# EAGLE design BMS (EAGLE 6.4)
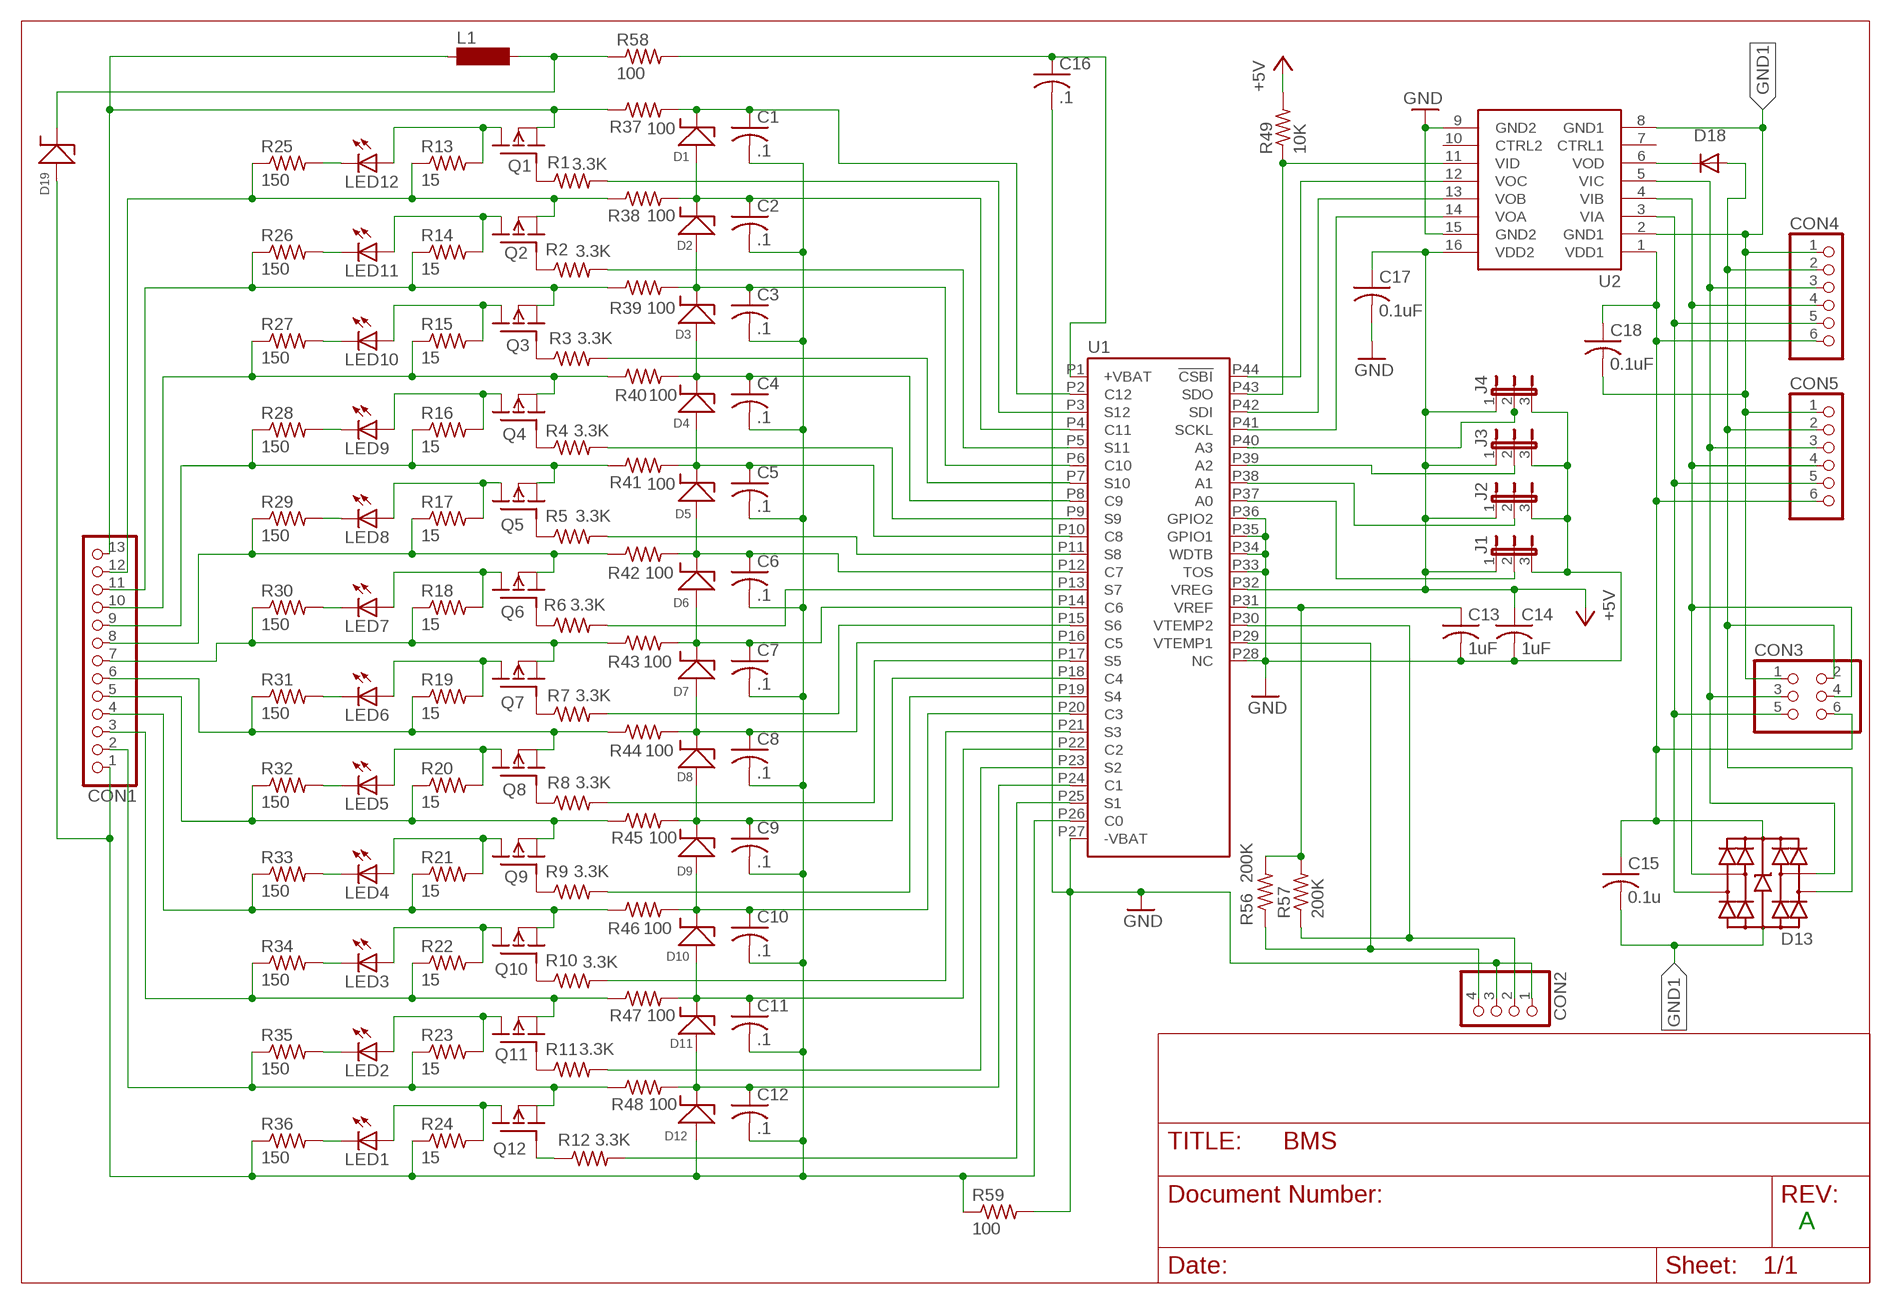
[diagram p0: schematic, sheet 1]

## Parts
C1  .1  C-USC0603  [C0603]
C2  .1  C-USC0603  [C0603]
C3  .1  C-USC0603  [C0603]
C4  .1  C-USC0603  [C0603]
C5  .1  C-USC0603  [C0603]
C6  .1  C-USC0603  [C0603]
C7  .1  C-USC0603  [C0603]
C8  .1  C-USC0603  [C0603]
C9  .1  C-USC0603  [C0603]
C10  .1  C-USC0603  [C0603]
C11  .1  C-USC0603  [C0603]
C12  .1  C-USC0603  [C0603]
C13  1uF  C-USC0603  [C0603]
C14  1uF  C-USC0603  [C0603]
C15  0.1u  C-USC0603  [C0603]
C16  .1  C-USC0603  [C0603]
C17  0.1uF  C-USC0603  [C0603]
C18  0.1uF  C-USC0603  [C0603]
CON1  PINHD-1X13/90  [1X13/90]
CON2  PINHD-1X4/90  [1X04/90]
CON3  PINHD-2X3/90  [2X03/90]
CON4  PINHD-1X6/90  [1X06/90]
CON5  PINHD-1X6/90  [1X06/90]
D1  PDZ7.5B  [SOD323]
D2  PDZ7.5B  [SOD323]
D3  PDZ7.5B  [SOD323]
D4  PDZ7.5B  [SOD323]
D5  PDZ7.5B  [SOD323]
D6  PDZ7.5B  [SOD323]
D7  PDZ7.5B  [SOD323]
D8  PDZ7.5B  [SOD323]
D9  PDZ7.5B  [SOD323]
D10  PDZ7.5B  [SOD323]
D11  PDZ7.5B  [SOD323]
D12  PDZ7.5B  [SOD323]
D13  TPD4E001DBV  [SOT23-6]
D18  DIODE0603  [LED-0603]
D19  MMSZ5265BTIG  [SOD-123_MINI-SMA]
J1  JP2E  [JP2]
J2  JP2E  [JP2]
J3  JP2E  [JP2]
J4  JP2E  [JP2]
L1  CHOKE  [CHOKE1206]
LED1  LED0603  [LED-0603]
LED2  LED0603  [LED-0603]
LED3  LED0603  [LED-0603]
LED4  LED0603  [LED-0603]
LED5  LED0603  [LED-0603]
LED6  LED0603  [LED-0603]
LED7  LED0603  [LED-0603]
LED8  LED0603  [LED-0603]
LED9  LED0603  [LED-0603]
LED10  LED0603  [LED-0603]
LED11  LED0603  [LED-0603]
LED12  LED0603  [LED-0603]
Q1  FDY102PZ  [SC89-3]
Q2  FDY102PZ  [SC89-3]
Q3  FDY102PZ  [SC89-3]
Q4  FDY102PZ  [SC89-3]
Q5  FDY102PZ  [SC89-3]
Q6  FDY102PZ  [SC89-3]
Q7  FDY102PZ  [SC89-3]
Q8  FDY102PZ  [SC89-3]
Q9  FDY102PZ  [SC89-3]
Q10  FDY102PZ  [SC89-3]
Q11  FDY102PZ  [SC89-3]
Q12  FDY102PZ  [SC89-3]
R1  3.3K  R-US_R0603  [R0603]
R2  3.3K  R-US_R0603  [R0603]
R3  3.3K  R-US_R0603  [R0603]
R4  3.3K  R-US_R0603  [R0603]
R5  3.3K  R-US_R0603  [R0603]
R6  3.3K  R-US_R0603  [R0603]
R7  3.3K  R-US_R0603  [R0603]
R8  3.3K  R-US_R0603  [R0603]
R9  3.3K  R-US_R0603  [R0603]
R10  3.3K  R-US_R0603  [R0603]
R11  3.3K  R-US_R0603  [R0603]
R12  3.3K  R-US_R0603  [R0603]
R13  15  R-US_R2512  [R2512]
R14  15  R-US_R2512  [R2512]
R15  15  R-US_R2512  [R2512]
R16  15  R-US_R2512  [R2512]
R17  15  R-US_R2512  [R2512]
R18  15  R-US_R2512  [R2512]
R19  15  R-US_R2512  [R2512]
R20  15  R-US_R2512  [R2512]
R21  15  R-US_R2512  [R2512]
R22  15  R-US_R2512  [R2512]
R23  15  R-US_R2512  [R2512]
R24  15  R-US_R2512  [R2512]
R25  150  R-US_R0603  [R0603]
R26  150  R-US_R0603  [R0603]
R27  150  R-US_R0603  [R0603]
R28  150  R-US_R0603  [R0603]
R29  150  R-US_R0603  [R0603]
R30  150  R-US_R0603  [R0603]
R31  150  R-US_R0603  [R0603]
R32  150  R-US_R0603  [R0603]
R33  150  R-US_R0603  [R0603]
R34  150  R-US_R0603  [R0603]
R35  150  R-US_R0603  [R0603]
R36  150  R-US_R0603  [R0603]
R37  100  R-US_R0603  [R0603]
R38  100  R-US_R0603  [R0603]
R39  100  R-US_R0603  [R0603]
R40  100  R-US_R0603  [R0603]
R41  100  R-US_R0603  [R0603]
R42  100  R-US_R0603  [R0603]
R43  100  R-US_R0603  [R0603]
R44  100  R-US_R0603  [R0603]
R45  100  R-US_R0603  [R0603]
R46  100  R-US_R0603  [R0603]
R47  100  R-US_R0603  [R0603]
R48  100  R-US_R0603  [R0603]
R49  10K  R-US_R0603  [R0603]
R56  200K  R-US_R0603  [R0603]
R57  200K  R-US_R0603  [R0603]
R58  100  R-US_R0603  [R0603]
R59  100  R-US_R0603  [R0603]
U1  LTC6803-2  [SSOP44]
U2  ADUM1411RW  [SO16W]

## Nets
+5V: C14.1 C17.1 J1.1 J2.1 J3.1 J4.1 R49.2 U1.P32(VREG) U2.16(VDD2)
+VBAT: C16.1 R58.2 U1.P1(+VBAT)
GND: C13.2 C14.2 C16.2 C17.2 CON2.1 CON2.3 J1.3 J2.3 J3.3 J4.3 R59.2 U1.P27(-VBAT) U1.P28(NC) U1.P33(TOS) U1.P34(WDTB) U1.P35(GPIO1) U1.P36(GPIO2) U2.9(GND2) U2.15(GND2)
GND1: C15.2 C18.2 CON3.1 CON4.1 CON5.1 D13.2(GND) U2.2(GND1) U2.8(GND1)
N$1: C8.1 D7.P$2 D8.P$1 R44.2 U1.P16(C5)
N$2: CON1.2 Q12.P$2(S) R23.1 R35.1 R48.1
N$3: C2.1 D1.P$2 D2.P$1 R38.2 U1.P4(C11)
N$4: C3.1 D2.P$2 D3.P$1 R39.2 U1.P6(C10)
N$5: C4.1 D3.P$2 D4.P$1 R40.2 U1.P8(C9)
N$6: C5.1 D4.P$2 D5.P$1 R41.2 U1.P10(C8)
N$7: C6.1 D5.P$2 D6.P$1 R42.2 U1.P12(C7)
N$8: C7.1 D6.P$2 D7.P$1 R43.2 U1.P14(C6)
N$10: C10.1 D9.P$2 D10.P$1 R46.2 U1.P20(C3)
N$11: C11.1 D10.P$2 D11.P$1 R47.2 U1.P22(C2)
N$12: C12.1 D11.P$2 D12.P$1 R48.2 U1.P24(C1)
N$13: C1.2 C2.2 C3.2 C4.2 C5.2 C6.2 C7.2 C8.2 C9.2 C10.2 C11.2 C12.2 CON1.1 D12.P$2 D19.A R24.1 R36.1 R59.1 U1.P26(C0)
N$14: Q1.P$1(G) R1.1
N$15: Q2.P$1(G) R2.1
N$16: Q3.P$1(G) R3.1
N$17: Q4.P$1(G) R4.1
N$18: Q5.P$1(G) R5.1
N$19: Q6.P$1(G) R6.1
N$20: Q7.P$1(G) R7.1
N$21: Q8.P$1(G) R8.1
N$22: Q9.P$1(G) R9.1
N$23: Q10.P$1(G) R10.1
N$24: Q11.P$1(G) R11.1
N$25: J3.2 U1.P39(A2)
N$26: LED12.A Q1.P$3(D) R13.2
N$27: LED12.C R25.2
N$28: R1.2 U1.P3(S12)
N$29: LED11.A Q2.P$3(D) R14.2
N$30: LED11.C R26.2
N$31: LED10.C R27.2
N$32: CON1.10 Q4.P$2(S) R15.1 R27.1 R40.1
N$33: LED10.A Q3.P$3(D) R15.2
N$34: R2.2 U1.P5(S11)
N$35: R3.2 U1.P7(S10)
N$36: R4.2 U1.P9(S9)
N$37: R5.2 U1.P11(S8)
N$38: R6.2 U1.P13(S7)
N$39: R7.2 U1.P15(S6)
N$40: R8.2 U1.P17(S5)
N$41: R9.2 U1.P19(S4)
N$42: R10.2 U1.P21(S3)
N$43: R11.2 U1.P23(S2)
N$44: R12.2 U1.P25(S1)
N$45: J1.2 U1.P37(A0)
N$46: CON1.13 L1.1 Q1.P$2(S) R37.1
N$47: LED7.C R30.2
N$48: LED9.A Q4.P$3(D) R16.2
N$49: LED9.C R28.2
N$50: LED8.A Q5.P$3(D) R17.2
N$51: LED7.A Q6.P$3(D) R18.2
N$52: LED8.C R29.2
N$53: CON1.12 Q2.P$2(S) R13.1 R25.1 R38.1
N$54: LED6.C R31.2
N$55: LED6.A Q7.P$3(D) R19.2
N$56: CON1.11 Q3.P$2(S) R14.1 R26.1 R39.1
N$57: CON3.2 CON4.2 CON5.2 D13.6(IO4) D18.A
N$58: LED5.A Q8.P$3(D) R20.2
N$59: LED5.C R32.2
N$60: LED4.C R33.2
N$61: LED3.C R34.2
N$62: LED4.A Q9.P$3(D) R21.2
N$63: LED3.A Q10.P$3(D) R22.2
N$64: LED2.C R35.2
N$65: LED1.A Q12.P$3(D) R24.2
N$66: LED2.A Q11.P$3(D) R23.2
N$67: CON1.9 Q5.P$2(S) R16.1 R28.1 R41.1
N$68: CON1.8 Q6.P$2(S) R17.1 R29.1 R42.1
N$69: CON1.7 Q7.P$2(S) R18.1 R30.1 R43.1
N$70: CON1.6 Q8.P$2(S) R19.1 R31.1 R44.1
N$71: CON1.5 Q9.P$2(S) R20.1 R32.1 R45.1
N$72: CON1.4 Q10.P$2(S) R21.1 R33.1 R46.1
N$73: CON1.3 Q11.P$2(S) R22.1 R34.1 R47.1
N$75: U1.P44(!CSBI) U2.12(VOC)
N$76: R49.1 U1.P43(SDO) U2.11(VID)
N$77: U1.P42(SDI) U2.13(VOB)
N$78: U1.P41(SCKL) U2.14(VOA)
N$83: CON3.5 CON4.5 CON5.5 D13.1(IO1) U2.3(VIA)
N$84: J2.2 U1.P38(A1)
N$85: CON3.4 CON4.4 CON5.4 D13.3(IO2) U2.4(VIB)
N$86: CON3.3 CON4.3 CON5.3 D13.4(IO3) U2.5(VIC)
N$89: D18.C U2.6(VOD)
N$91: J4.2 U1.P40(A3)
N$96: CON2.4 R56.1 U1.P29(VTEMP1)
N$97: CON2.2 R57.1 U1.P30(VTEMP2)
N$101: C1.1 D1.P$1 R37.2 U1.P2(C12)
N$102: D19.C L1.2 R58.1
N$103: LED1.C R36.2
N$105: Q12.P$1(G) R12.1
N$116: C9.1 D8.P$2 D9.P$1 R45.2 U1.P18(C4)
VDD1: C15.1 C18.1 CON3.6 CON4.6 CON5.6 D13.5(VCC) U2.1(VDD1)
VREF: C13.1 R56.2 R57.2 U1.P31(VREF)
Unconnected: U2.7(CTRL1) U2.10(CTRL2)

## Notes on the sheet
- A

## Library data of the parts
C1-C18 = rcl:C-US: CAPACITOR, American symbol
CON1 = pinhead:PINHD-1X13: PIN HEADER
CON2 = pinhead:PINHD-1X4: PIN HEADER
CON3 = pinhead:PINHD-2X3: PIN HEADER
CON4 CON5 = pinhead:PINHD-1X6: PIN HEADER
D1-D12 = Richard1:PDZ7.5B
D13 = m_diode:TPD4E001: 4-CHANNEL ESD PROTECTION ARRAY WITH 1.5-pF IO CAPACITANCE 4-Channel ESD Clamp Array to Enhance System-Level ESD Protection Exceeds IEC61000-4-2 (Level 4) ESD Protection Requirements ±8-kV IEC 61000-4-2 Contact Discharge ±15-kV IEC 61000-4-2 Air-Gap Discharge ±15-kV Human-Body Model (HBM) 5.5-A Peak Pulse Current (8/20-us Pulse) Low 1.5-pF Input Capacitance Low 1-nA (Max) Leakage Current 0.9-V to 5.5-V Supply-Voltage Range Space-Saving DRL, DBV, DCK, and DRS Package Options Alternate 2-, 3-, 6-Channel Options Available: TPD2E001, TPD3E001, and TPD6E001 DESCRIPTION The TPD4E001 is a low-capacitance ±15-kV ESD-protection diode array designed to protect sensitive electronics attached to communication lines. Each channel consists of a pair of diodes that steer ESD current pulses to VCC or GND. The TPD4E001 protects against ESD pulses up to ±15-kV Human-Body Model (HBM), ±8-kV Contact Discharge, and ±15-kV Air-Gap Discharge, as specified in IEC 61000-4-2. This device has a 1.5-pF IO capacitance per channel, making it ideal for use in high-speed data IO interfaces. The ultra low leakage current (1 nA max) is suitable for precision analog measurements in applications like glucose meters, heart rate monitors, etc. The TPD4E001 is available in DRL, DBV (SOT-23), DCK (SC-70), DRS (QFN), and DPK (PUSON) packages and is specified for –40°C to 85°C operation.; MANUF: TI; PARTNUM: TPD4E001DBV
D18 = Richard1:DIODE
D19 = Richard1:MMSZ5265BTIG
J1-J4 = jumper:JP2E: JUMPER
L1 = Richard:CHOKE
LED1-LED12 = Richard1:LED: LEDs Standard schematic elements and footprints for 5mm, 3mm, 1206, and 0603 sized LEDs. 5mm - Spark Fun Electronics SKU : Comp-SBL
Q1-Q12 = Richard1:FDY102PZ: Digikey FDY102PZCT-ND
R1-R49 R56-R59 = rcl:R-US_: RESISTOR, American symbol
U1 = Richard:LTC6803-2: LTC6803-2 Multicell Battery Stack Monitor DESCRIPTION The LTC®6803 is a 2nd generation, complete battery moni- toring IC that includes a 12-bit ADC, a precision voltage reference, a high voltage input multiplexer and a serial interface. Each LTC6803 can measure up to 12 series connected battery cells or supercapacitors. Many LTC6803 devices can be stacked to measure the voltage of each cell in a long battery string. Each LTC6803-2/LTC6803-4 has an individually addressable serial interface, allowing up to 16 LTC6803-2/LTC6803-4 devices to interface to one control processor and operate simultaneously. Each cell input has an associated MOSFET switch for discharging overcharged cells. The LTC6803-2 connects the bottom of the stack to V– internally. It is pin compatible with the LTC6802-2, providing a drop-in upgrade. The LTC6803-4 separates the bottom of the stack from V–, improving cell 1 measurement accuracy. The LTC6803 provides a standby mode to reduce supply current to 12μA. Furthermore, the LTC6803 can be powered from an isolated supply, providing a technique to reduce battery stack current draw to zero. The related LTC6803-1 and LTC6803-3 offer a serial in- terface that allows the serial ports of multiple LTC6803-1 or LTC6803-3 devices to be daisy chained without opto- couplers or isolators.; MANUF: Linear Technology; PARTNUM: LTC6803IG-2#PBF
U2 = Richard1:ADUM1411: Quad-Channel Digital Isolators The ADuM141x1 are four-channel digital isolators based on Analog Devices, Inc. iCoupler® technology. Combining high speed CMOS and monolithic air core transformer technologies, these isolation components provide outstanding performance characteristics superior to alternatives such as optocoupler devices. By avoiding the use of LEDs and photodiodes, iCoupler devices remove the design difficulties commonly associated with opto- couplers. The usual concerns that arise with optocouplers, such as uncertain current transfer ratios, nonlinear transfer functions, and temperature and lifetime effects, are eliminated with the simple iCoupler digital interfaces and stable performance characteristics. The need for external drivers and other discrete components is eliminated with these iCoupler products. Furthermore, iCoupler devices consume one-tenth to one-sixth the power of optocou- plers at comparable signal data rates. The ADuM141x isolators provide four independent isolation channels in a variety of channel configurations and data rates (see the Ordering Guide) up to 10 Mbps. All models operate with the supply voltage on either side ranging from 2.7 V to 5.5 V, providing compatibility with lower voltage systems as well as enabling voltage translation functionality across the isolation barrier. All products also have a default output control pin. This allows the user to define the logic state the outputs are to adopt in the absence of the input power. Unlike other optocoupler alternatives, the ADuM141x isolators have a patented refresh feature that ensures dc correctness in the absence of input logic transitions and during power-up/power-down conditions.; MANUF: Analog Devices; PARTNUM: ADuM1411A

## Board
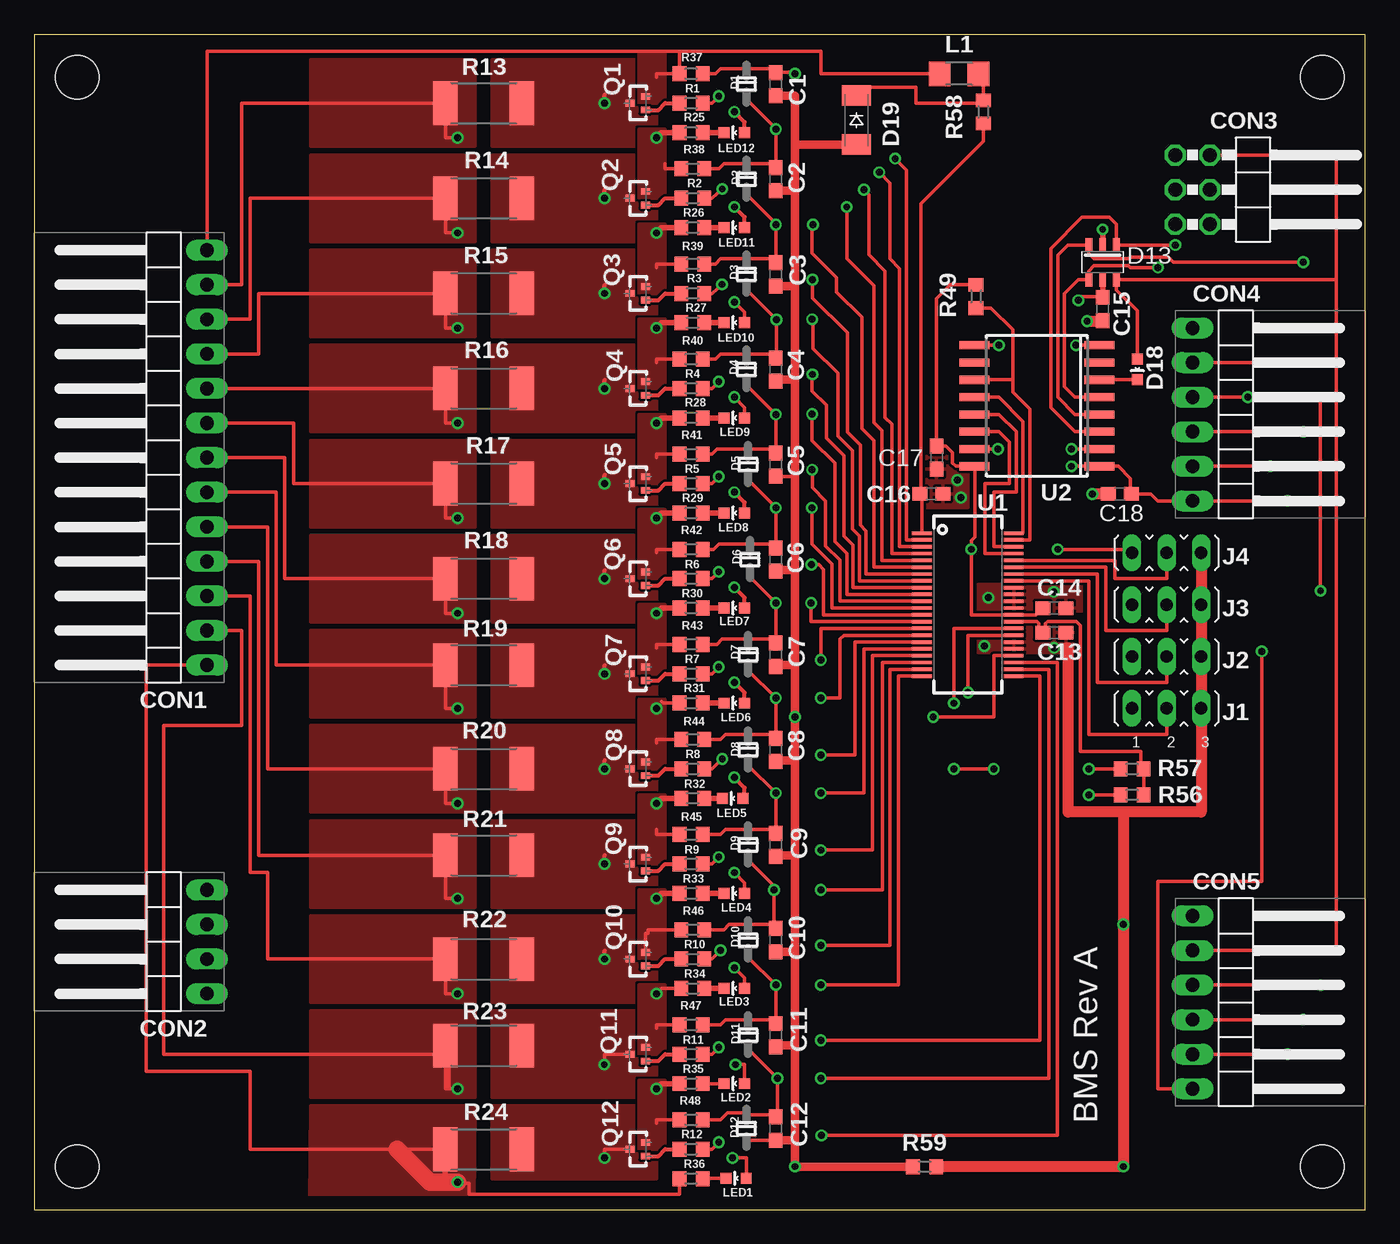
[diagram p1: board, top side]
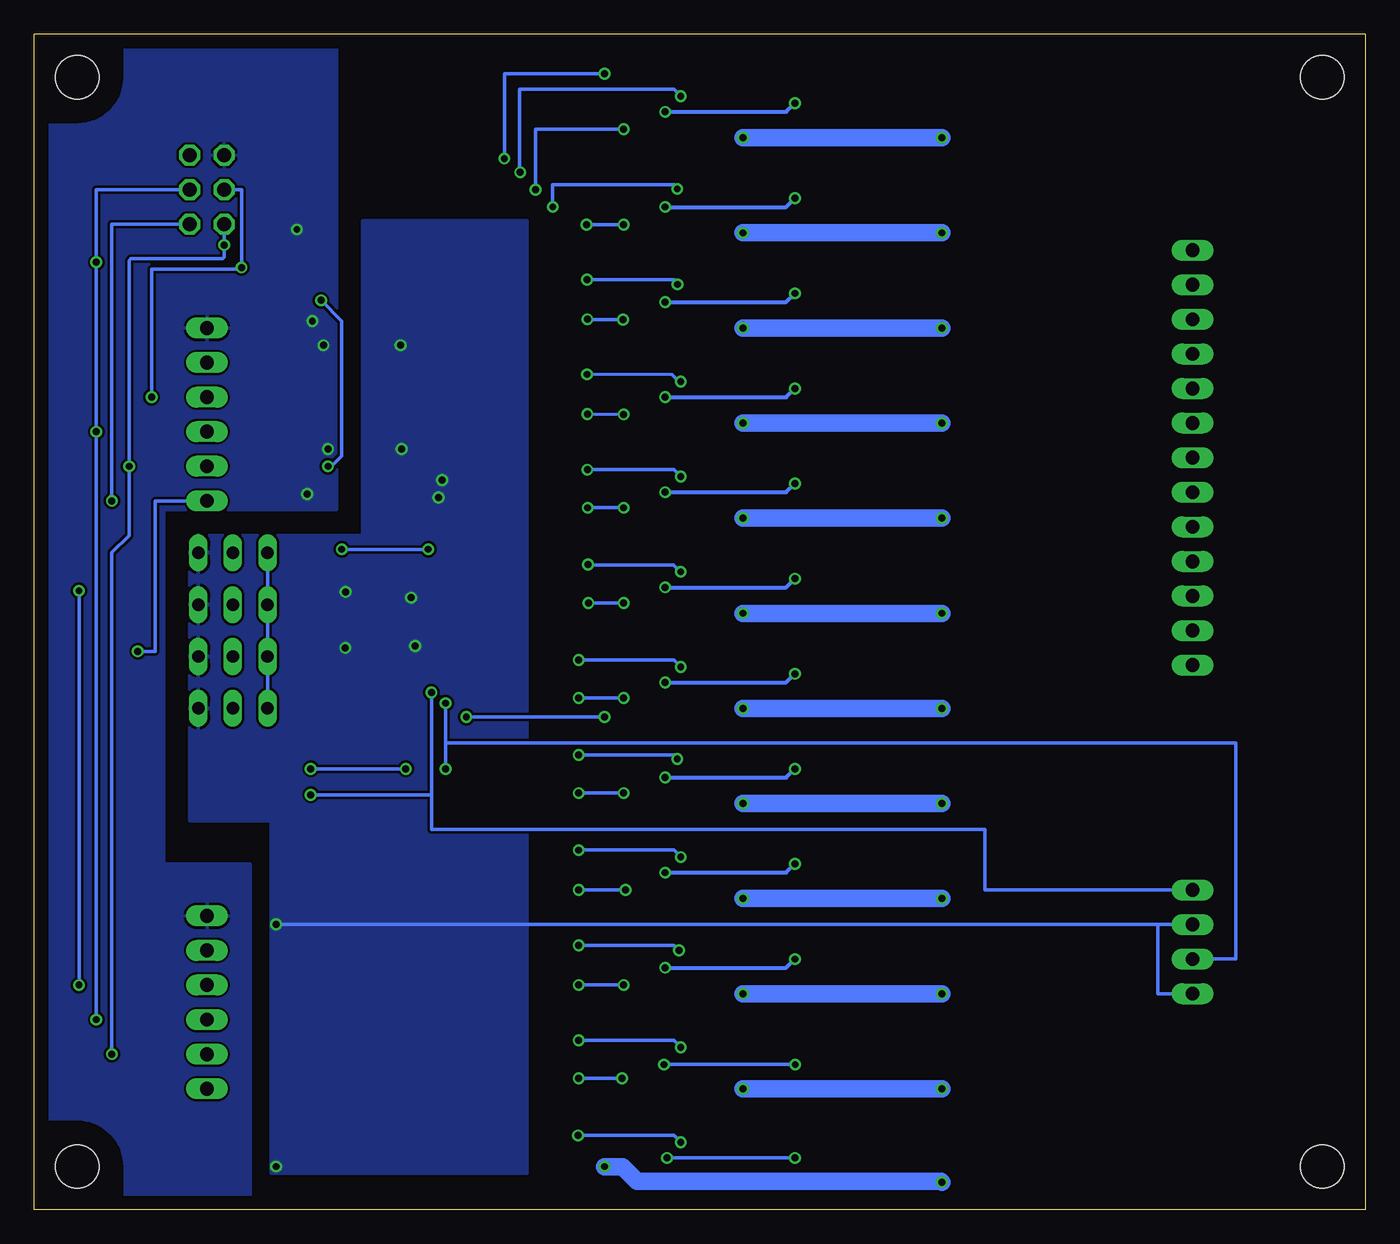
[diagram p2: board, bottom side, seen from below]

Size 97.79 x 86.36 mm. Coordinates in mm from the lower left corner, seen from the top.
Outline: 0,0 97.79,0 97.79,86.36 0,86.36 0,0
Copper layers (1*16): Top 0.035mm / dielectric 1.5mm / Bottom 0.035mm
Design rules "apcircuits_sm_restring": minimum track width 7mil, minimum drill 10mil, track to track 7mil, track to pad 7mil, pad to pad 7mil, via to via 7mil, smd to smd 7mil, copper to edge 40mil, drill to drill 8mil, minimum pad ring 7mil, minimum via ring 7mil, stop-mask expansion 4mil, vias tented up to drill 20mil, thermal gap 8mil
Holes 3.17 mm at 3.17,3.17 3.17,83.19 94.61,83.19 94.61,3.17
bRestrict: 10 lines

### Footprints (pad centres in the part's own frame; a part is rotated, then mirrored left to right if it is on the bottom)
C0603 = smd 1.1 x 1: 1 -0.85,0; 2 0.85,0
1X13/90 = drill 1.016 long: 1 -15.24,-3.81; 2 -12.7,-3.81; 3 -10.16,-3.81; 4 -7.62,-3.81; 5 -5.08,-3.81; 6 -2.54,-3.81; 7 0,-3.81; 8 2.54,-3.81; 9 5.08,-3.81; 10 7.62,-3.81; 11 10.16,-3.81; 12 12.7,-3.81; 13 15.24,-3.81
1X04/90 = drill 1.016 long: 1 -3.81,-3.81; 2 -1.27,-3.81; 3 1.27,-3.81; 4 3.81,-3.81
2X03/90 = drill 1.016 octagon: 1 -2.54,-6.35; 2 -2.54,-3.81; 3 0,-6.35; 4 0,-3.81; 5 2.54,-6.35; 6 2.54,-3.81
1X06/90 = drill 1.016 long: 1 -6.35,-3.81; 2 -3.81,-3.81; 3 -1.27,-3.81; 4 1.27,-3.81; 5 3.81,-3.81; 6 6.35,-3.81
SOD323 = smd 0.75 x 0.4: P$1 0,0; P$2 2.25,0
SOT23-6 = smd 0.508 x 1.016: 1 -1.016,-1.27; 2 0,-1.27; 3 1.016,-1.27; 4 1.016,1.27; 5 0,1.27; 6 -1.016,1.27
LED-0603 = smd 0.8 x 0.8: A 0,-0.75; C 0,0.75
SOD-123_MINI-SMA = smd 1.5 x 2.1: A 1.8,0; C -1.8,0
JP2 = drill 0.914 long: 1 -2.54,0; 2 0,0; 3 2.54,0
CHOKE1206 = smd 1.6 x 1.803: 1 -1.422,0; 2 1.422,0
SC89-3 = smd 0.5 x 0.66: P$1 -0.5,-0.46; P$2 0.5,-0.46; P$3 0,0.68
R0603 = smd 1 x 1.1: 1 -0.85,0; 2 0.85,0
R2512 = smd 1.8 x 3.2: 1 -2.8,0; 2 2.8,0
SSOP44 = smd 0.25 x 1.45: P1 -5.25,-3.375; P2 -4.75,-3.375; P3 -4.25,-3.375; P4 -3.75,-3.375; P5 -3.25,-3.375; P6 -2.75,-3.375; P7 -2.25,-3.375; P8 -1.75,-3.375; P9 -1.25,-3.375; P10 -0.75,-3.375; P11 -0.25,-3.375; P12 0.25,-3.375; P13 0.75,-3.375; P14 1.25,-3.375; P15 1.75,-3.375; P16 2.25,-3.375; P17 2.75,-3.375; P18 3.25,-3.375; P19 3.75,-3.375; P20 4.25,-3.375; P21 4.75,-3.375; P22 5.25,-3.375; P23 5.25,3.375; P24 4.75,3.375; P25 4.25,3.375; P26 3.75,3.375; P27 3.25,3.375; P28 2.75,3.375; P29 2.25,3.375; P30 1.75,3.375; P31 1.25,3.375; P32 0.75,3.375; P33 0.25,3.375; P34 -0.25,3.375; P35 -0.75,3.375; P36 -1.25,3.375; P37 -1.75,3.375; P38 -2.25,3.375; P39 -2.75,3.375; P40 -3.25,3.375; P41 -3.75,3.375; P42 -4.25,3.375; P43 -4.75,3.375; P44 -5.25,3.375
SO16W = smd 0.6 x 2.2: 1 -4.445,-4.6; 2 -3.175,-4.6; 3 -1.905,-4.6; 4 -0.635,-4.6; 5 0.635,-4.6; 6 1.905,-4.6; 7 3.175,-4.6; 8 4.445,-4.6; 9 4.445,4.6; 10 3.175,4.6; 11 1.905,4.6; 12 0.635,4.6; 13 -0.635,4.6; 14 -1.905,4.6; 15 -3.175,4.6; 16 -4.445,4.6

### Placement (x,y rotation side)
C1  54.48,82.68 270 top
C2  54.48,75.69 270 top
C3  54.48,68.71 270 top
C4  54.48,61.72 270 top
C5  54.48,54.74 270 top
C6  54.48,47.75 270 top
C7  54.48,40.77 270 top
C8  54.48,33.78 270 top
C9  54.48,26.8 270 top
C10  54.48,19.81 270 top
C11  54.48,12.83 270 top
C12  54.48,5.97 270 top
C13  74.93,42.39 0 top
C14  74.93,44.2 0 top
C15  78.49,66.17 270 top
C16  65.91,52.58 0 top
C17  66.29,55.24 270 top
C18  79.76,52.58 180 top
CON1  8.89,55.24 90 top
CON2  8.89,19.68 90 top
CON3  90.17,74.93 270 top
CON4  88.9,58.42 270 top
CON5  88.9,15.24 270 top
D1  52.32,83.82 270 top
D2  52.32,76.83 270 top
D3  52.32,69.85 270 top
D4  52.32,62.87 270 top
D5  52.45,55.88 270 top
D6  52.58,48.9 270 top
D7  52.45,41.91 270 top
D8  52.45,34.92 270 top
D9  52.45,27.94 270 top
D10  52.45,20.95 270 top
D11  52.45,13.97 270 top
D12  52.32,7.11 270 top
D13  78.49,69.6 180 top
D18  81.03,61.72 180 top
D19  60.4,80.04 270 top
J1  83.19,36.83 0 top
J2  83.19,40.64 0 top
J3  83.19,44.45 0 top
J4  83.19,48.26 0 top
L1  67.94,83.44 0 top
LED1  51.56,2.31 90 top
LED2  51.44,9.27 90 top
LED3  51.44,16.26 90 top
LED4  51.44,23.24 90 top
LED5  51.31,30.23 90 top
LED6  51.44,37.21 90 top
LED7  51.44,44.2 90 top
LED8  51.44,51.18 90 top
LED9  51.44,58.17 90 top
LED10  51.44,65.15 90 top
LED11  51.44,72.14 90 top
LED12  51.44,79.12 90 top
Q1  44.45,81.28 90 top
Q2  44.45,74.3 90 top
Q3  44.45,67.31 90 top
Q4  44.45,60.33 90 top
Q5  44.45,53.34 90 top
Q6  44.45,46.35 90 top
Q7  44.45,39.37 90 top
Q8  44.45,32.38 90 top
Q9  44.45,25.4 90 top
Q10  44.45,18.41 90 top
Q11  44.45,11.43 90 top
Q12  44.45,4.45 90 top
R1  48.26,81.28 0 top
R2  48.39,74.3 0 top
R3  48.39,67.31 0 top
R4  48.26,60.33 0 top
R5  48.26,53.34 0 top
R6  48.26,46.35 0 top
R7  48.26,39.37 0 top
R8  48.39,32.38 0 top
R9  48.26,25.4 0 top
R10  48.39,18.41 0 top
R11  48.26,11.43 0 top
R12  48.26,4.45 0 top
R13  33.02,81.28 0 top
R14  33.02,74.3 0 top
R15  33.02,67.31 0 top
R16  33.02,60.33 0 top
R17  33.02,53.34 0 top
R18  33.02,46.35 0 top
R19  33.02,40.01 0 top
R20  33.02,32.38 0 top
R21  33.02,26.04 0 top
R22  33.02,18.41 0 top
R23  33.02,12.06 0 top
R24  33.02,4.45 0 top
R25  48.26,79.12 0 top
R26  48.39,72.14 0 top
R27  48.39,65.15 0 top
R28  48.26,58.17 0 top
R29  48.26,51.18 0 top
R30  48.26,44.2 0 top
R31  48.26,37.21 0 top
R32  48.39,30.23 0 top
R33  48.26,23.24 0 top
R34  48.39,16.26 0 top
R35  48.26,9.27 0 top
R36  48.26,2.29 0 top
R37  48.26,83.44 0 top
R38  48.39,76.45 0 top
R39  48.39,69.47 0 top
R40  48.26,62.48 0 top
R41  48.26,55.5 0 top
R42  48.26,48.51 0 top
R43  48.26,41.53 0 top
R44  48.39,34.54 0 top
R45  48.26,27.56 0 top
R46  48.39,20.57 0 top
R47  48.26,13.59 0 top
R48  48.26,6.6 0 top
R49  69.19,67.08 90 top
R56  80.64,30.48 0 top
R57  80.64,32.38 0 top
R58  69.72,80.64 270 top
R59  65.41,3.17 0 top
U1  68.58,44.45 270 top
U2  73.66,59.05 90 top

### Tracks (layer width: path | path; a pad name or v marks a point on that pad's centre or on a via)
+5V  (via drill 0.51)
  Top 0.254: 69.19,67.94 R49.2 69.18,67.94 67.31,67.94 66.29,66.93 C17.1 66.97,56.09 67.44,55.63 67.44,54.86 67.69,54.61 U2.16 69.09,54.61 69.09,49.4 68.83,49.15 v68.83,48.51 68.83,43.7 U1.P32 73.58,43.7 C14.1 | v75.18,48.51 80.39,48.51 J4.1
  Bottom 0.254: J3.1 J2.1 J1.1 | 80.64,44.3 J3.1 | J3.1 J4.1 | v75.18,48.51 v68.83,48.51
+VBAT
  Top 0.254: 69.56,79.96 R58.2 69.72,78.49 65.15,73.91 65.15,52.83 65.19,52.79 C16.1 65.2,52.56 U1.P1
GND  (via drill 0.51)
  Top 0.254: U2.9 v70.87,63.5 | U2.15 v70.79,55.88
  Top 0.813: 75.84,41.27 75.95,41.27 75.95,29.21 80.01,29.21 | J4.3 85.72,29.21 80.01,29.21 | 80.01,29.21 v80.01,20.95 v80.01,3.17 R59.2 | C16.2 66.8,52.58
  Bottom 0.254: CON2.3 15.24,20.95 | 15.24,20.95 v80.01,20.95 | CON2.1 15.24,15.88 15.24,20.95
  other vias: 69.8,41.4 70.1,44.96 74.9,45.39 74.93,41.27 67.82,53.59 68.07,52.32
  pour Bottom: 61.59,72.64 61.59,2.67 80.39,2.67 80.39,28.57 86.36,28.57 86.36,49.53 73.66,49.53 73.66,72.64
  pour Top (rank 5): 69.34,42.8 69.34,40.89 76.33,40.89 76.33,42.8
  pour Top (rank 5): 76.96,45.97 76.96,43.94 69.34,43.94 69.34,45.97
  pour Top (rank 5): 65.53,55.37 68.58,55.37 68.58,51.56 65.53,51.56
GND1  (via drill 0.51)
  Top 0.254: v76.53,63.5 U2.8 | v76.2,55.88 U2.2
  Top 0.406: v78.49,72.01 D13.2
  Top 0.813: v77.34,65.28 78.45,65.28 C15.2 | C18.2 v77.72,52.58
  pour Bottom: 97.16,85.72 75.56,85.72 75.56,51.44 88.27,51.44 88.27,25.4 81.92,25.4 81.92,0.64 97.16,0.64
N$1  (via drill 0.51)
  Top 0.254: R44.2 50.42,34.54 50.8,34.92 D8.P$1 54.48,34.92 | 54.48,34.92 v54.48,37.59 52.45,39.62 D7.P$2 | v57.78,37.59 59.18,37.59 59.18,41.91 59.47,42.2 U1.P16 | C8.1 54.48,34.92
  Bottom 0.254: v54.48,37.59 v57.78,37.59
N$2  (via drill 0.51)
  Top 0.254: R48.1 45.72,6.6 45.72,6.35 | R23.1 30.22,8.89 30.48,8.89 | v31.11,8.89 30.48,8.89 | CON1.2 15.24,42.55 15.24,35.56 9.53,35.56 9.53,11.43 30.48,11.43 30.48,8.89
  Top 0.406: R35.1 46.1,9.27 v45.72,8.89
  Bottom 1.27: v45.72,8.89 v31.11,8.89
  pour Top (rank 4, no thermals): 32.38,14.61 20.32,14.61 20.32,8.26 32.38,8.26
  pour Top (rank 2, no thermals): 46.35,4.45 44.45,4.45 44.45,9.53 46.35,9.53
N$3  (via drill 0.51)
  Top 0.254: R38.2 50.29,76.45 50.67,76.83 D2.P$1 54.19,76.83 C2.1 v54.48,79.38 54.48,79.41 D1.P$2 | v60.96,74.93 61.32,74.57 61.32,70.16 62.51,68.96 62.51,58.19 62.99,57.71 62.99,48.2 U1.P4
  Bottom 0.254: v54.48,79.38 60.96,79.38 v60.96,74.93
N$4  (via drill 0.51)
  Top 0.254: R39.2 50.04,69.47 50.42,69.85 D3.P$1 54.19,69.85 C3.1 v54.48,72.36 54.48,72.43 D2.P$2 | v57.2,72.36 57.15,72.31 57.15,70.26 58.95,68.45 58.95,67.41 60.81,65.56 60.81,57.38 61.67,56.52 61.67,47.2 U1.P6
  Bottom 0.254: v54.48,72.36 v57.2,72.36
N$5  (via drill 0.51)
  Top 0.254: R40.2 50.04,62.48 50.42,62.87 D4.P$1 54.19,62.87 C4.1 54.51,62.56 54.53,62.59 v54.53,65.38 52.32,67.59 D3.P$2 | U1.P8 60.63,46.2 60.63,49.51 60.12,50.01 60.12,55.75 59.03,56.84 59.03,61.44 57.2,63.27 57.2,65.35 v57.15,65.41
  Bottom 0.254: v54.53,65.38 57.12,65.38 v57.15,65.41
N$6  (via drill 0.51)
  Top 0.254: 54.48,55.75 54.36,55.88 D5.P$1 50.16,55.88 49.78,55.5 R41.2 | 54.48,55.75 v54.48,58.42 52.32,60.58 D4.P$2 | U1.P10 59.69,45.2 59.69,48.21 58.83,49.07 58.83,54.84 57.15,56.52 v57.15,58.45 | C5.1 54.48,55.75
  Bottom 0.254: v57.15,58.45 v54.48,58.42
N$7  (via drill 0.51)
  Top 0.254: R42.2 49.91,48.51 50.29,48.9 D6.P$1 54.19,48.9 C6.1 v54.48,51.56 54.48,51.6 D5.P$2 | U1.P12 58.62,44.2 58.62,47.42 57.15,48.9 57.15,51.54 v57.12,51.56
  Bottom 0.254: v57.12,51.56 v54.48,51.56
N$8  (via drill 0.51)
  Top 0.254: R43.2 50.16,41.53 50.55,41.91 52.32,41.91 52.45,42.04 D7.P$1 54.19,41.91 C7.1 v54.48,44.58 52.58,46.48 D6.P$2 | U1.P14 57.07,43.2 v57.07,44.58
  Bottom 0.254: v57.07,44.58 v54.48,44.58
N$10  (via drill 0.51)
  Top 0.254: R46.2 50.67,20.57 51.05,20.95 D10.P$1 54.61,20.95 54.61,20.66 C10.1 54.36,20.66 v54.36,23.5 54.36,23.79 D9.P$2 | v57.78,23.5 62.31,23.5 62.31,40.01 62.31,40.18 62.31,40.2 U1.P20
  Bottom 0.254: v54.36,23.5 v57.78,23.5
N$11  (via drill 0.51)
  Top 0.254: R47.2 50.42,13.59 50.8,13.97 D11.P$1 54.32,13.97 C11.1 v54.48,16.51 52.45,18.54 D10.P$2 | v57.78,16.51 63.5,16.51 63.5,39.2 U1.P22
  Bottom 0.254: v57.78,16.51 v54.48,16.51
N$12  (via drill 0.51)
  Top 0.254: R48.2 50.42,6.6 50.93,7.11 D12.P$1 52.45,6.99 54.48,6.99 C12.1 54.61,6.82 v54.61,9.65 52.58,11.68 52.45,11.68 D11.P$2 | U1.P24 74.52,39.7 74.52,9.65 v57.78,9.65
  Bottom 0.254: v54.61,9.65 v57.78,9.65
N$13  (via drill 0.51)
  Top 0.254: 54.65,4.95 C12.2 52.62,5.12 52.32,4.83 D12.P$2 | 54.74,4.87 54.65,4.95 | 54.65,4.95 54.48,4.95 | 56.01,76.83 55.88,76.96 | 55.88,53.87 54.61,53.87 | 54.61,53.87 54.51,53.87 C5.2 | C5.2 54.6,53.89 54.61,53.87 | R24.1 26.67,4.45 15.88,4.45 15.88,10.16 8.26,10.16 8.26,40.01 CON1.1 | v66.04,36.2 70.48,36.2 70.48,40.7 U1.P26 | R36.1 47.41,1.14 31.95,1.14 31.95,1.96 30.2,1.96 | D19.A 60.33,78.23
  Top 0.305: 30.22,3.44 R24.1
  Top 0.406: 30.2,1.96 R24.1
  Top 0.61: C11.2 54.7,12.06 55.88,12.06 | 55.88,12.06 55.88,5.08 | 55.88,5.08 55.84,5.12 C12.2 | 30.22,3.44 30.22,3.17 30.48,3.17 | 55.88,5.08 v55.88,3.17 R59.1 | C10.2 55.79,18.96 55.88,19.05 | 55.88,19.05 55.88,12.06 | 55.88,19.05 55.88,26.04 | 55.88,26.04 55.88,33.02 | 55.88,33.02 v55.88,36.2 55.88,40.01 | 55.88,40.01 55.88,46.99 | C6.2 54.48,46.99 55.88,46.99 | C7.2 54.48,40.01 55.88,40.01 | C8.2 54.48,33.02 55.88,33.02 | C9.2 54.48,26.04 55.88,26.04 | C1.2 55.88,81.83 55.88,78.23 | 55.88,78.23 55.88,76.96 55.88,74.84 | 55.88,74.84 55.88,67.86 | 55.88,67.86 55.88,60.96 | 55.88,60.96 55.88,53.87 55.88,46.99 | C2.2 55.88,74.84 | C3.2 55.88,67.86 | C4.2 54.61,60.87 54.61,60.96 55.88,60.96 | 60.33,78.23 55.88,78.23
  Top 1.27: v31.11,2.03 29.08,2.03 26.67,4.45
  Bottom 0.254: v55.88,36.2 v66.04,36.2
  Bottom 1.27: v55.88,3.17 54.59,3.17 53.49,2.08 31.17,2.08 v31.11,2.03
  pour Top (rank 4, no thermals): 32.38,7.62 20.32,7.62 20.24,0.53 32.31,0.53
N$14
  Top 0.305: Q1.P$1 45.85,80.78 46.35,81.28 R1.1 47.62,81.28
N$15
  Top 0.305: Q2.P$1 45.85,73.8 46.35,74.3 R2.1 47.62,74.3
N$16
  Top 0.305: Q3.P$1 45.85,66.81 46.35,67.31 R3.1 47.62,67.31
N$17
  Top 0.305: Q4.P$1 45.85,59.83 46.35,60.33 R4.1 47.62,60.33
N$18
  Top 0.305: Q5.P$1 45.85,52.84 46.35,53.34 R5.1 47.62,53.34
N$19
  Top 0.305: Q6.P$1 45.85,45.85 46.35,46.35 R6.1 47.62,46.35
N$20
  Top 0.305: Q7.P$1 45.85,38.87 46.35,39.37 R7.1 47.62,39.37
N$21
  Top 0.305: Q8.P$1 45.85,31.89 46.35,32.38 R8.1 47.62,32.38
N$22
  Top 0.305: Q9.P$1 45.85,24.9 46.35,25.4 R9.1 47.62,25.4
N$23
  Top 0.305: Q10.P$1 45.85,17.91 46.35,18.41 R10.1 47.62,18.41
N$24
  Top 0.305: Q11.P$1 45.85,10.93 46.35,11.43 R11.1 47.62,11.43
N$25
  Top 0.254: U1.P39 78.74,47.2 78.74,42.55 83.19,42.55 J3.2
N$26  (via drill 0.51)
  Top 0.305: LED12.A 52.19,79.89 v51.44,80.64 | v41.91,81.28 41.91,81.92
  Bottom 0.305: v51.44,80.64 42.55,80.64 v41.91,81.28
  pour Top (rank 4, no thermals): 33.66,84.45 45.72,84.45 45.72,78.11 33.66,78.11
N$27
  Top 0.406: R25.2 LED12.C
N$28  (via drill 0.51)
  Top 0.254: R1.2 49.78,81.28 v50.29,81.79 | U1.P3 63.58,48.7 63.58,69.14 62.87,69.85 62.87,75.41 v62.08,76.2
  Bottom 0.254: v50.29,81.79 50.8,82.3 62.13,82.3 62.13,76.78 v62.08,76.2
N$29  (via drill 0.51)
  Top 0.305: LED11.A 52.19,72.91 v51.44,73.66 | v41.91,74.3 41.91,74.93
  Bottom 0.305: v51.44,73.66 42.55,73.66 v41.91,74.3
  pour Top (rank 4, no thermals): 33.66,77.47 45.72,77.47 45.72,71.12 33.66,71.12
N$30
  Top 0.406: 49.11,72.14 R26.2 LED11.C
N$31
  Top 0.406: 49.11,65.15 R27.2 LED10.C
N$32  (via drill 0.51)
  Top 0.254: CON1.10 16.51,62.87 16.51,67.31 R15.1 30.22,64.77 v31.11,64.77 | R40.1 45.72,62.48 45.72,62.23 | R27.1 47.41,65.15
  Top 0.406: 47.41,65.15 46.1,65.15 v45.72,64.77
  Bottom 1.27: v45.72,64.77 v31.11,64.77
  pour Top (rank 4, no thermals): 32.38,70.48 20.32,70.48 20.32,64.14 32.38,64.14
  pour Top (rank 2, no thermals): 46.35,60.33 44.45,60.33 44.45,65.41 46.35,65.41
N$33  (via drill 0.51)
  Top 0.254: LED10.A 52.19,65.92 v51.44,66.67
  Top 0.305: v41.91,67.31 41.91,67.94
  Bottom 0.305: v51.44,66.67 42.55,66.67 v41.91,67.31
  pour Top (rank 4, no thermals): 33.66,70.48 45.72,70.48 45.72,64.14 33.66,64.14
N$34  (via drill 0.51)
  Top 0.254: 49.11,74.3 R2.2 49.78,74.3 v50.55,74.98 | v59.69,73.66 59.69,69.85 61.67,67.87 61.67,57.84 62.28,57.23 62.28,47.7 U1.P5
  Bottom 0.254: v50.55,74.98 50.8,75.31 59.69,75.31 v59.69,73.66
N$35  (via drill 0.51)
  Top 0.254: 49.11,67.31 R3.2 49.78,67.31 v50.52,67.97 | 65.23,46.7 U1.P7 61.11,46.7 61.11,49.86 60.68,50.29 60.68,56.19 59.74,57.12 59.74,64.41 57.17,66.98 v57.17,68.33
  Bottom 0.254: v50.52,67.97 50.8,68.33 v57.17,68.33
N$36  (via drill 0.51)
  Top 0.254: R4.2 49.78,60.33 v50.29,60.83 | v57.17,61.37 57.15,61.34 57.15,60.15 58.19,59.11 58.19,56.69 59.49,55.4 59.49,49.51 60.15,48.84 60.15,45.7 U1.P9
  Bottom 0.254: v50.29,60.83 50.42,60.83 50.93,61.34 v57.17,61.37
N$37  (via drill 0.51)
  Top 0.254: R5.2 49.78,53.34 v50.29,53.85 | U1.P11 59.18,44.7 59.18,47.73 58.14,48.77 58.14,52.07 57.17,53.03 57.17,54.33 v57.15,54.36
  Bottom 0.254: v57.15,54.36 50.77,54.36 50.29,53.87 v50.29,53.85
N$38  (via drill 0.51)
  Top 0.254: R6.2 49.78,46.35 v50.29,46.86 | U1.P13 57.99,43.7 57.99,47.04 57.63,47.4 v57.1,47.4
  Bottom 0.254: v50.29,46.86 50.32,46.86 50.83,47.37 57.07,47.37 v57.1,47.4
N$39  (via drill 0.51)
  Top 0.254: R7.2 49.78,39.37 v50.29,39.88 | v57.78,40.39 57.78,42.55 57.78,42.7 U1.P15
  Bottom 0.254: v50.29,39.88 50.8,40.39 v57.78,40.39
N$40  (via drill 0.51)
  Top 0.254: v50.55,33.12 49.78,32.38 R8.2 49.11,32.38 | v57.78,33.4 60.3,33.4 60.3,41.7 U1.P17
  Bottom 0.254: v50.55,33.12 50.8,33.4 v57.78,33.4
N$41  (via drill 0.51)
  Top 0.254: R9.2 49.78,25.4 v50.29,25.91 | v57.78,26.42 61.59,26.42 61.59,40.7 U1.P19
  Bottom 0.254: v50.29,25.91 50.8,26.42 v57.78,26.42
N$42  (via drill 0.51)
  Top 0.254: 49.11,18.41 R10.2 49.78,18.41 v50.42,19.05 | v57.78,19.43 62.87,19.43 62.87,39.7 | U1.P21 62.87,39.7 | 62.87,39.7
  Bottom 0.254: v50.42,19.05 50.8,19.43 v57.78,19.43
N$43  (via drill 0.51)
  Top 0.254: R11.2 49.78,11.43 v50.29,11.94 | v57.78,12.45 73.86,12.45 73.86,39.12 73.86,39.2 U1.P23
  Bottom 0.254: v50.29,11.94 50.8,12.45 v57.78,12.45
N$44  (via drill 0.51)
  Top 0.254: R12.2 49.78,4.45 v50.29,4.95 | v57.84,5.46 75.16,5.46 75.16,40.2 U1.P25
  Bottom 0.254: v50.29,4.95 50.8,5.46 v57.84,5.46
N$45
  Top 0.254: U1.P37 77.47,46.2 77.47,34.92 83.19,34.92 J1.2
N$46
  Top 0.254: 47.5,85.09 12.7,85.09 CON1.13 | 47.5,85.09 47.41,85 R37.1 45.72,83.44 45.72,83.19 | L1.1 57.78,83.44 57.78,85.09 47.5,85.09
  pour Top (rank 2, no thermals): 46.35,81.28 44.45,81.28 44.45,85.09 46.35,85.09
N$47
  Top 0.406: R30.2 LED7.C
N$48  (via drill 0.51)
  Top 0.254: v51.44,59.69 52.2,58.93 LED9.A
  Top 0.305: v41.91,60.33 41.91,60.96
  Bottom 0.305: v51.44,59.69 42.55,59.69 v41.91,60.33
  pour Top (rank 4, no thermals): 33.66,63.5 45.72,63.5 45.72,57.15 33.66,57.15
N$49
  Top 0.406: R28.2 LED9.C
N$50  (via drill 0.51)
  Top 0.305: LED8.A 52.19,51.95 v51.44,52.7 | v41.91,53.34 41.91,53.98
  Bottom 0.305: v51.44,52.7 42.55,52.7 v41.91,53.34
  pour Top (rank 4, no thermals): 33.66,56.52 45.72,56.52 45.72,50.16 33.66,50.16
N$51  (via drill 0.51)
  Top 0.305: LED7.A 52.19,44.97 v51.44,45.72 | v41.91,46.35 41.91,46.99
  Bottom 0.305: v51.44,45.72 42.55,45.72 v41.91,46.35
  pour Top (rank 4, no thermals): 33.66,49.53 45.72,49.53 45.72,43.18 33.66,43.18
N$52
  Top 0.406: R29.2 LED8.C
N$53  (via drill 0.51)
  Top 0.254: CON1.12 15.24,67.94 15.24,81.28 R13.1 30.22,78.74 v31.11,78.74 | R38.1 46.35,76.45 46.35,76.83
  Top 0.406: R25.1 46.1,79.12 v45.72,78.74
  Bottom 1.27: v45.72,78.74 v31.11,78.74
  pour Top (rank 4, no thermals): 32.38,84.45 20.32,84.45 20.32,78.11 32.38,78.11
  pour Top (rank 2, no thermals): 46.35,74.3 44.45,74.3 44.45,79.38 46.35,79.38
N$54
  Top 0.406: R31.2 LED6.C
N$55  (via drill 0.51)
  Top 0.305: LED6.A 52.19,37.98 v51.44,38.73 | v41.91,39.37 41.91,40.01
  Bottom 0.305: v51.44,38.73 42.55,38.73 v41.91,39.37
  pour Top (rank 4, no thermals): 33.66,42.55 45.72,42.55 45.72,36.2 33.66,36.2
N$56  (via drill 0.51)
  Top 0.254: CON1.11 15.88,65.41 15.88,74.3 R14.1 30.22,71.75 v31.11,71.75 | R39.1 45.72,69.47 45.72,69.22 | R26.1 47.41,72.14
  Top 0.406: 47.41,72.14 46.1,72.14 v45.72,71.75
  Bottom 1.27: v45.72,71.75 v31.11,71.75
  pour Top (rank 4, no thermals): 32.38,77.47 20.32,77.47 20.32,71.12 32.38,71.12
  pour Top (rank 2, no thermals): 46.35,67.31 44.45,67.31 44.45,72.39 46.35,72.39
N$57
  Top 0.254: CON3.2 95.63,77.47 95.63,68.33 | 95.63,68.33 95.63,62.23 | CON4.2 95.63,62.23 | CON5.2 95.63,19.05 95.63,62.23 | D18.A 81.03,66.04 79.5,67.56 D13.6 95.63,68.33
N$58  (via drill 0.51)
  Top 0.254: 52.19,30.23 LED5.A
  Top 0.305: 52.19,30.23 52.19,31 v51.44,31.75 | v41.91,32.38 41.91,33.02
  Bottom 0.305: v51.44,31.75 42.55,31.75 v41.91,32.38
  pour Top (rank 4, no thermals): 33.66,35.56 45.72,35.56 45.72,29.21 33.66,29.21
N$59
  Top 0.406: 49.11,30.23 R32.2 LED5.C 50.69,30.23
N$60
  Top 0.406: R33.2 LED4.C
N$61
  Top 0.406: 49.11,16.26 R34.2 49.53,16.26 LED3.C
N$62  (via drill 0.51)
  Top 0.254: v51.44,24.77 52.2,24 52.2,23.25 LED4.A
  Top 0.305: v41.91,25.4 41.91,26.04
  Bottom 0.305: v51.44,24.77 42.55,24.77 v41.91,25.4
  pour Top (rank 4, no thermals): 33.66,28.57 45.72,28.57 45.72,22.23 33.66,22.23
N$63  (via drill 0.51)
  Top 0.254: 52.19,17.03 52.2,17.02 | 52.19,17.03 v51.44,17.78 | 52.19,17.03 LED3.A
  Top 0.305: v41.91,18.41 41.91,19.05
  Bottom 0.305: v51.44,17.78 42.55,17.78 v41.91,18.41
  pour Top (rank 4, no thermals): 33.66,21.59 45.72,21.59 45.72,15.24 33.66,15.24
N$64
  Top 0.254: R35.2 LED2.C
N$65  (via drill 0.51)
  Top 0.254: v41.91,3.81 41.91,4.45 Q12.P$3 | LED1.A 52.31,3.81 v51.31,3.81
  Bottom 0.254: v51.31,3.81 v41.91,3.81
  pour Top (rank 4, no thermals): 33.66,7.62 45.72,7.62 45.72,2.29 33.66,2.29
N$66  (via drill 0.51)
  Top 0.254: LED2.A 52.19,10.67 v51.51,10.67 | v41.88,10.67 41.88,11.43 Q11.P$3
  Bottom 0.254: 51.51,10.69 v51.51,10.67 v41.88,10.67
  pour Top (rank 4, no thermals): 33.66,14.61 45.72,14.61 45.72,8.26 33.66,8.26
N$67  (via drill 0.51)
  Top 0.254: v31.11,57.78 30.22,57.78 R16.1 CON1.9 | R41.1 45.72,55.5 45.72,55.24
  Top 0.406: R28.1 46.1,58.17 v45.72,57.78
  Bottom 1.27: v45.72,57.78 v31.11,57.78
  pour Top (rank 4, no thermals): 32.38,63.5 20.32,63.5 20.32,57.15 32.38,57.15
  pour Top (rank 2, no thermals): 46.35,53.34 44.45,53.34 44.45,58.42 46.35,58.42
N$68  (via drill 0.51)
  Top 0.254: v31.11,50.8 30.22,50.8 R17.1 19.05,53.34 19.05,57.78 CON1.8 | R42.1 45.72,48.51 45.72,48.26
  Top 0.406: R29.1 46.1,51.18 v45.72,50.8
  Bottom 1.27: v45.72,50.8 v31.11,50.8
  pour Top (rank 4, no thermals): 32.38,56.52 20.32,56.52 20.32,50.16 32.38,50.16
  pour Top (rank 2, no thermals): 46.35,46.35 44.45,46.35 44.45,51.44 46.35,51.44
N$69  (via drill 0.51)
  Top 0.254: v31.11,43.81 30.22,43.81 R18.1 18.41,46.35 18.41,55.24 CON1.7 | R43.1 45.72,41.53 45.72,41.27
  Top 0.406: R30.1 46.1,44.2 v45.72,43.81
  Bottom 1.27: v45.72,43.81 v31.11,43.81
  pour Top (rank 4, no thermals): 32.38,49.53 20.32,49.53 20.32,43.18 32.38,43.18
  pour Top (rank 2, no thermals): 46.35,39.37 44.45,39.37 44.45,44.45 46.35,44.45
N$70  (via drill 0.51)
  Top 0.254: R31.1 46.23,37.21 46.1,37.34 | v31.11,36.83 30.22,36.83 R19.1 17.78,40.01 17.78,52.7 CON1.6 | R44.1 45.72,34.54 45.72,34.29
  Bottom 1.27: v31.11,36.83 v45.72,36.83
  pour Top (rank 4, no thermals): 32.38,42.55 20.32,42.55 20.32,36.2 32.38,36.2
  pour Top (rank 2, no thermals): 46.35,32.38 44.45,32.38 44.45,37.47 46.35,37.47
N$71  (via drill 0.51)
  Top 0.254: R32.1 47.41,30.23 | v31.11,29.84 30.22,29.84 R20.1 17.14,32.38 17.14,50.16 CON1.5 | R45.1 45.72,27.56 45.72,27.94
  Top 0.406: 47.41,30.23 46.1,30.23 v45.72,29.84
  Bottom 1.27: v45.72,29.84 v31.11,29.84
  pour Top (rank 4, no thermals): 32.38,35.56 20.32,35.56 20.32,29.21 32.38,29.21
  pour Top (rank 2, no thermals): 46.35,25.4 44.45,25.4 44.45,30.48 46.35,30.48
N$72  (via drill 0.51)
  Top 0.254: v31.11,22.86 30.22,22.86 R21.1 16.51,26.04 16.51,47.62 CON1.4 | R46.1 45.09,20.57 45.09,20.32 44.91,20.32 Q10.P$2
  Top 0.406: R33.1 46.1,23.24 v45.72,22.86
  Bottom 1.27: v45.72,22.86 v31.11,22.86
  pour Top (rank 4, no thermals): 32.38,28.57 20.32,28.57 20.32,22.23 32.38,22.23
  pour Top (rank 2, no thermals): 46.35,18.41 44.45,18.41 44.45,23.5 46.35,23.5
N$73  (via drill 0.51)
  Top 0.254: CON1.3 15.88,45.09 15.88,24.77 17.14,24.77 17.14,18.41 R22.1 30.22,15.88 v31.11,15.88 | v45.72,15.88 46.1,16.26 R34.1 | R47.1 45.72,13.59 45.72,13.34
  Bottom 1.27: v31.11,15.88 v45.72,15.88
  pour Top (rank 4, no thermals): 32.38,21.59 20.32,21.59 20.32,15.24 32.38,15.24
  pour Top (rank 2, no thermals): 46.35,11.43 44.45,11.43 44.45,16.51 46.35,16.51
N$75
  Top 0.254: U1.P44 72.64,49.7 72.64,57.91 70.87,59.69 U2.12
N$76
  Top 0.254: U1.P43 73.15,49.2 73.15,58.8 71.88,60.07 71.88,60.96 | 71.88,60.96 U2.11 | R49.1 70.29,66.23 71.88,64.64 71.88,60.96
N$77
  Top 0.254: U1.P42 70.48,48.7 70.48,52.7 72.14,52.7 72.14,57.15 70.87,58.42 U2.13
N$78
  Top 0.254: U1.P41 69.85,48.2 69.85,53.34 71.5,53.34 71.63,53.34 71.63,56.39 70.87,57.15 U2.14
N$83  (via drill 0.51)
  Top 0.254: v90.81,54.61 CON4.5 | v92.08,11.43 CON5.5 | U2.3 76.45,57.15 74.68,58.93 74.68,70.61 76.96,72.9 78.99,72.9 79.5,72.39 D13.1 v83.82,70.87
  Bottom 0.254: CON3.5 v83.82,70.87 83.82,69.98 83.95,69.85 90.68,69.85 90.81,69.72 v90.81,54.61 90.81,49.53 92.08,48.26 v92.08,11.43
N$84
  Top 0.254: J2.2 83.19,38.73 78.11,38.73 78.11,46.69 71.95,46.69 U1.P38
N$85  (via drill 0.51)
  Top 0.254: CON4.4 v93.22,57.15 | CON5.4 v93.22,13.97 | U2.4 76.45,58.42 75.18,59.69 75.18,70.1 75.95,70.87 D13.3 77.47,70.23 77.85,69.85 80.39,69.85 80.52,69.98 83.31,69.98 83.69,69.6 v93.22,69.6
  Bottom 0.254: CON3.4 93.22,74.93 v93.22,69.6 v93.22,57.15 v93.22,13.97
N$86  (via drill 0.51)
  Top 0.254: CON4.3 v89.15,59.69 94.49,59.69 v94.49,45.47 | CON5.3 v94.49,16.51 | U2.5 76.45,59.69 75.69,60.45 75.69,67.31 76.71,68.33 D13.4 77.47,68.96 77.85,69.34 80.39,69.34 80.52,69.22 v82.55,69.22
  Bottom 0.254: CON3.3 82.55,74.93 82.55,69.09 | v94.49,16.51 v94.49,45.47 | 82.55,69.09 89.15,69.09 v89.15,59.69 | v82.55,69.22 82.42,69.22 82.55,69.09
N$89
  Top 0.254: U2.6 81.01,60.96 D18.C
N$91
  Top 0.254: U1.P40 79.38,47.7 79.38,46.35 83.19,46.35 J4.2
N$96  (via drill 0.51)
  Top 0.254: R56.1 v77.47,30.48 | U1.P29 68.61,42.2 v68.61,38
  Bottom 0.254: CON2.4 27.94,23.5 27.94,27.94 68.58,27.94 68.58,30.48 | v68.61,38 68.58,38 68.58,30.73 68.58,30.48 | v77.47,30.48 68.58,30.48
N$97  (via drill 0.51)
  Top 0.254: R57.1 v77.47,32.38 | v70.48,32.38 v67.56,32.38 | U1.P30 67.56,42.7 v67.56,37.21
  Bottom 0.254: CON2.2 9.53,18.41 9.53,34.29 67.56,34.29 | 67.56,34.29 v67.56,37.21 | v77.47,32.38 v70.48,32.38 | v67.56,32.38 67.56,34.29
N$101  (via drill 0.51)
  Top 0.254: R37.2 50.04,83.44 50.42,83.82 D1.P$1 54.19,83.82 C1.1 54.61,83.53 54.61,83.57 | 54.48,83.57 54.61,83.57 | 54.61,83.57 55.75,83.57 v55.88,83.44 | U1.P2 64.08,49.2 64.08,76.38 v63.25,77.22
  Bottom 0.254: v55.88,83.44 63.25,83.44 v63.25,77.22
N$102
  Top 0.254: L1.2 69.72,83.44 R58.1 69.72,81.28 64.77,81.28 64.77,82.45 60.48,82.45 60.4,82.37 D19.C
N$103
  Top 0.254: 48.9,2.54 48.9,2.29 R36.2 49.11,2.31 LED1.C
N$105
  Top 0.254: R12.1 47.37,4.45
  Top 0.305: Q12.P$1 45.85,3.94 46.35,4.45 47.37,4.45
N$116  (via drill 0.51)
  Top 0.254: R45.2 50.42,27.56 50.8,27.94 D9.P$1 54.61,27.94 54.61,27.65 C9.1 v54.48,30.61 52.45,32.64 D8.P$2 | v57.78,30.61 60.96,30.61 60.96,41.2 U1.P18
  Bottom 0.254: v54.48,30.61 v57.78,30.61
VDD1  (via drill 0.51)
  Top 0.254: CON5.6 82.55,8.89 82.55,24.13 90.17,24.13 v90.17,41.02 | v92.08,52.07 CON4.6 82.55,52.07 82.04,52.58 C18.1 80.52,52.67 80.52,53.72 79.63,54.61 U2.1 v76.2,54.61 | v76.71,66.8 76.96,67.06 78.45,67.06 C15.1
  Top 0.406: D13.5 C15.1
  Bottom 0.254: CON3.6 92.08,72.39 v92.08,52.07 | v90.17,41.02 88.9,41.02 88.9,52.07 CON4.6 | v76.2,54.61 75.95,54.61 75.18,55.37 75.18,65.28 v76.71,66.8
VREF
  Top 0.254: R56.2 R57.2 81.28,32.38 81.28,33.66 76.83,33.66 76.83,42.93 76.56,43.2 74.45,43.2 74.3,43.05 74.3,42.63 C13.1 73.79,42.71 73.79,43.05 73.64,43.2 U1.P31

### Text on the board
tPlace: 1 | 2 | 3 | BMS Rev A